# EAGLE design pcb2-1 (EAGLE 9.6.2)
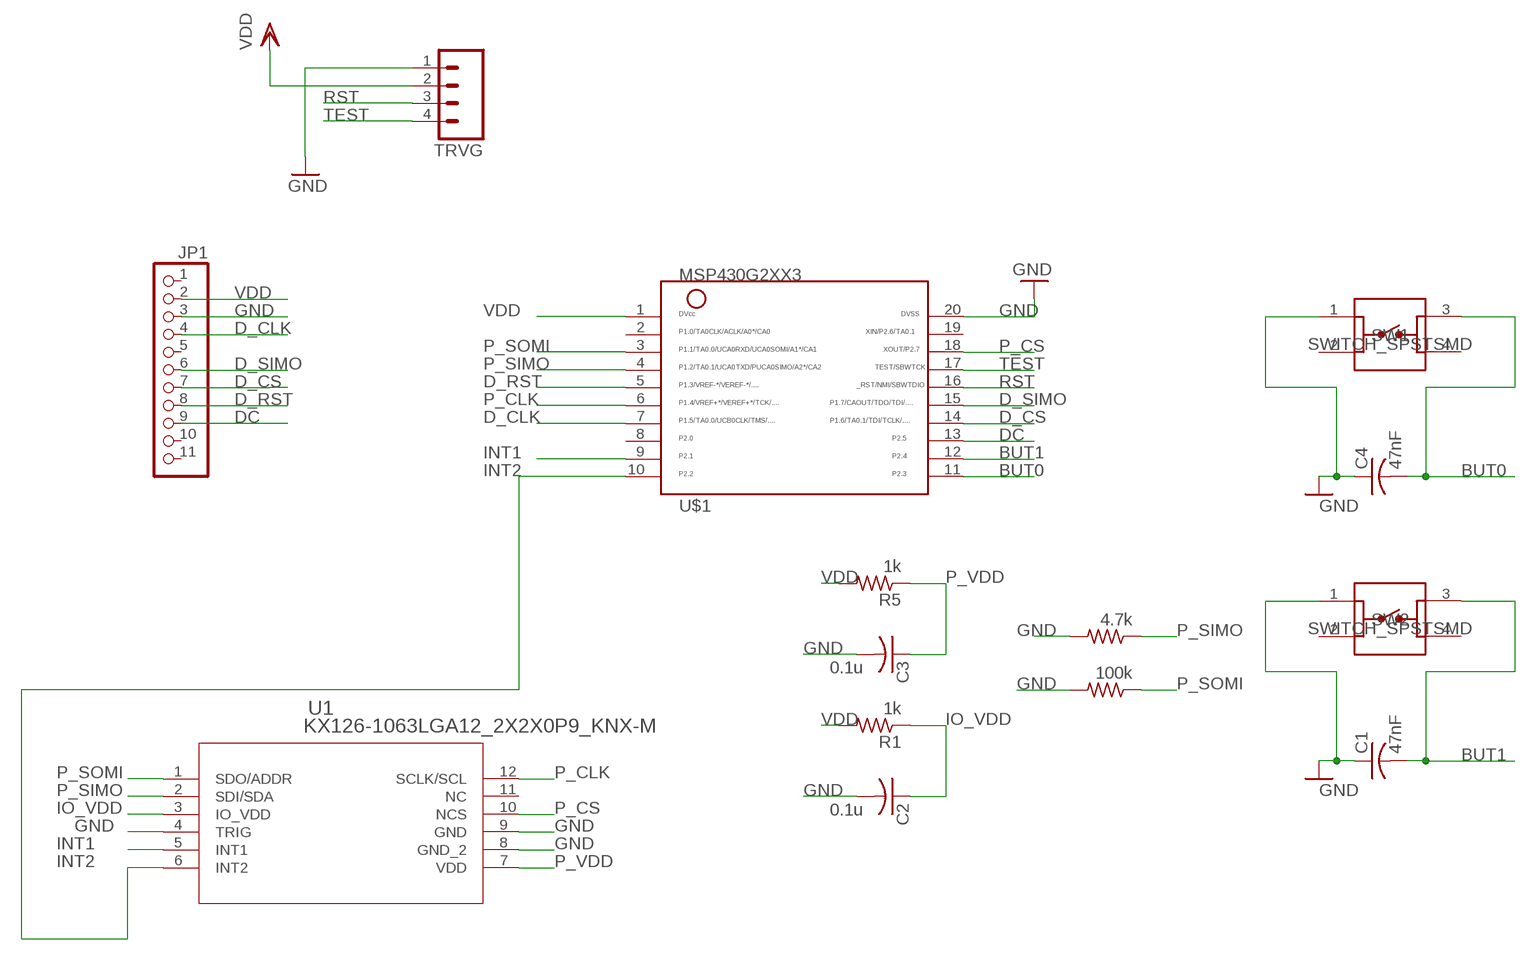
[diagram p0: schematic, sheet 1]

## Parts
C1  47nF  C-USC0603  [C0603]
C2  0.1u  C-USC0603  [C0603]
C3  0.1u  C-USC0603  [C0603]
C4  47nF  C-USC0603  [C0603]
JP1  HEADER-1X11  [1X11_ROUND]
R1  1k  R-US_R0402  [R0402]
R2  100k  R-US_R0402  [R0402]
R3  4.7k  R-US_R0402  [R0402]
R5  1k  R-US_R0402  [R0402]
SW1  SWITCH_SPSTSMD  [SW_1571563-4]
SW2  SWITCH_SPSTSMD  [SW_1571563-4]
TRVG  M04LOCK  [1X04_LOCK]
U1  KX126-1063LGA12_2X2X0P9_KNX-M  [LGA12_2X2X0P9_KNX-M]
U$1  MSP430G2XX3TSSOP  [PW20]

## Nets
BUT0: C4.2 SW1.3 U$1.11
BUT1: C1.2 SW2.3 U$1.12
D_CLK: JP1.4 U$1.7
D_CS: JP1.7 U$1.14
D_RST: JP1.8 U$1.5
D_SIMO: JP1.6 U$1.15
DC: JP1.9 U$1.13
GND: C1.1 C2.2 C3.2 C4.1 JP1.3 R2.2 R3.2 SW1.1 SW2.1 TRVG.1 U1.4(TRIG) U1.8(GND_2) U1.9(GND) U$1.20
INT1: U1.5(INT1) U$1.9
INT2: U1.6(INT2) U$1.10
IO_VDD: C2.1 R1.1 U1.3(IO_VDD)
P_CLK: U1.12(SCLK/SCL) U$1.6
P_CS: U1.10(NCS) U$1.18
P_SIMO: R3.1 U1.2(SDI/SDA) U$1.4
P_SOMI: R2.1 U1.1(SDO/ADDR) U$1.3
P_VDD: C3.1 R5.1 U1.7(VDD)
RST: TRVG.3 U$1.16
TEST: TRVG.4 U$1.17
VDD: JP1.2 R1.2 R5.2 TRVG.2 U$1.1
Unconnected: JP1.1 JP1.5 JP1.10 JP1.11 SW1.2 SW1.4 SW2.2 SW2.4 U1.11(NC) U$1.2 U$1.8 U$1.19

## Library data of the parts
C1-C4 = rcl:C-US: CAPACITOR, American symbol; SPICEPREFIX: C
JP1 = microbuilder:HEADER-1X11
R1-R3 R5 = rcl:R-US_: RESISTOR, American symbol; SPICEPREFIX: R
SW1 SW2 = ELEC327:SWITCH_SPST: TE Connectivity Alcoswitch, 6mm Switch Tactile OFF (ON) SPST Round Button PC Pins 0.05A 24VDC 100000Cycles 2.55N Thru-Hole Loose Through Hole Version 1825910-7 <https://www.digikey.com/en/products/detail/te-connectivity-alcoswitch-switches/1825910-7/1731414> Surface Mount Version 1571563-4 <https://www.digikey.com/en/products/detail/te-connectivity-alcoswitch-switches/1571563-4/2400231>
TRVG = Pendant:M04: Header 4 Standard 4-pin 0.1" header. Use with straight break away headers (SKU : PRT-00116), right angle break away headers (PRT-00553), swiss pins (PRT-00743), machine pins (PRT-00117), and female headers (PRT-00115). Molex polarized connector foot print use with SKU : PRT-08231 with associated crimp pins and housings.
U1 = Juan_pedometer:KX126-1063; COPYRIGHT: Copyright (C) 2021 Ultra Librarian. All rights reserved.; DIGI-KEY_PART_NUMBER_1: 1191-1058-2-ND; DIGI-KEY_PART_NUMBER_2: 1191-1058-1-ND; DIGI-KEY_PART_NUMBER_3: 1191-1058-6-ND; MANUFACTURER_PART_NUMBER: KX126-1063; MFR_NAME: Kionix
U$1 = ELEC327:MSP430G2XX3: MSP430G2XX3 PDIP (N) 20 Pin Package

## Board
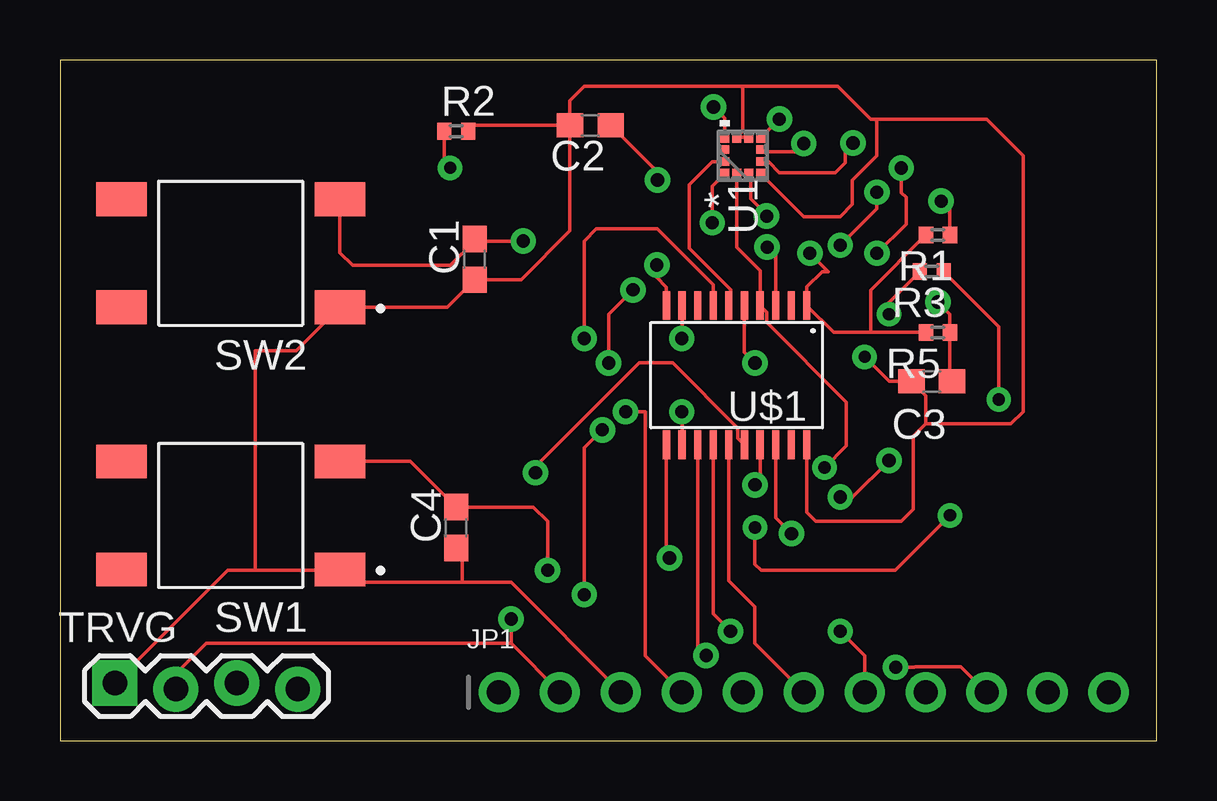
[diagram p1: board, top side]
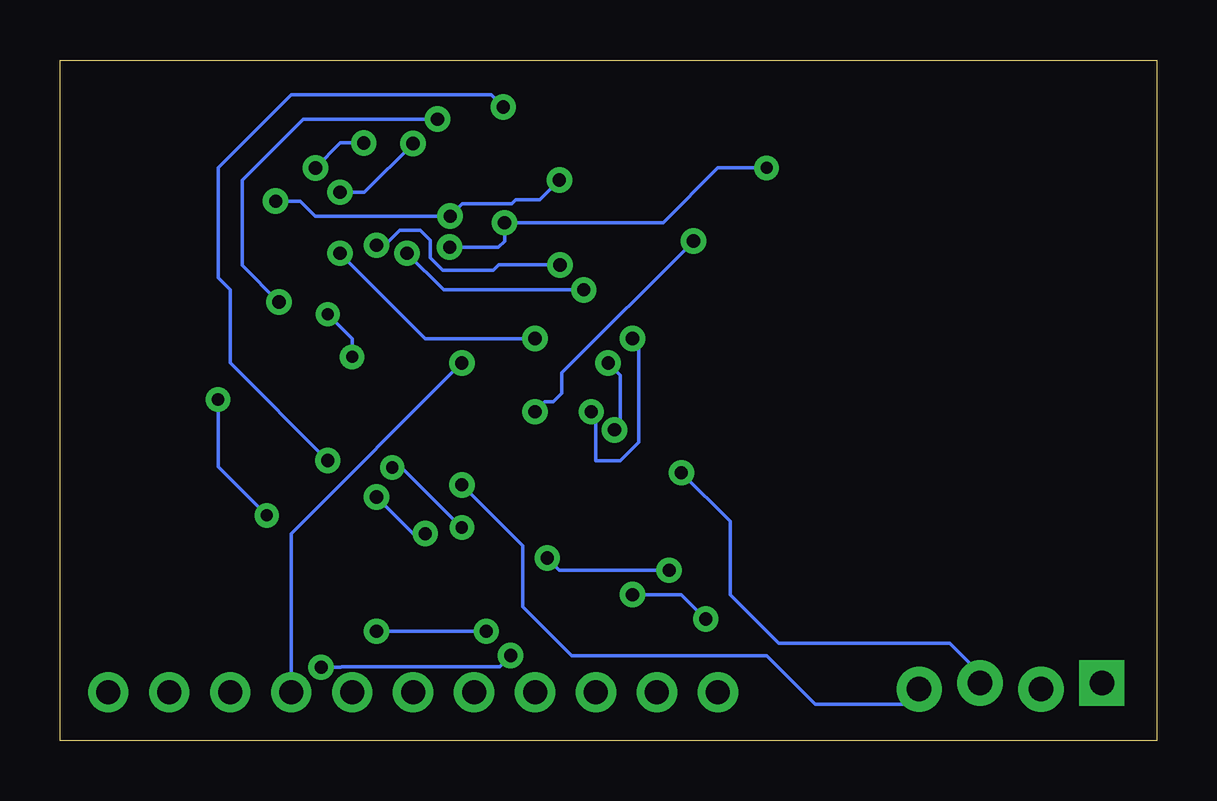
[diagram p2: board, bottom side, seen from below]

Size 45.7 x 28.37 mm. Coordinates in mm from the lower left corner, seen from the top.
Outline: 0,0 45.7,0 45.7,28.37 0,28.37 0,0
Copper layers (1*16): Top 0.035mm / dielectric 1.5mm / Bottom 0.035mm
Design rules "AdvancedCircuitsBarebones": minimum track width 6mil, minimum drill 20mil, track to track 6mil, track to pad 6mil, pad to pad 6mil, via to via 6mil, smd to smd 6mil, copper to edge 10mil, drill to drill 6mil, minimum pad ring 12mil, minimum via ring 10mil, stop-mask expansion 4mil, vias tented up to drill 25mil, thermal gap 10mil

### Footprints (pad centres in the part's own frame; a part is rotated, then mirrored left to right if it is on the bottom)
C0603 = smd 1.1 x 1: 1 -0.85,0; 2 0.85,0
1X11_ROUND = drill 1 pad 1.676: 1 -12.7,0; 2 -10.16,0; 3 -7.62,0; 4 -5.08,0; 5 -2.54,0; 6 0,0; 7 2.54,0; 8 5.08,0; 9 7.62,0; 10 10.16,0; 11 12.7,0
R0402 = smd 0.6 x 0.7: 1 -0.5,0; 2 0.5,0
SW_1571563-4 = smd 2.1 x 1.4: 1 -4.55,2.25; 2 4.55,2.25; 3 -4.55,-2.25; 4 4.55,-2.25
1X04_LOCK = drill 1.016 pad 1.88 square: 1 0,0.127 | drill 1.016 pad 1.88: 2 2.54,-0.127; 3 5.08,0.127; 4 7.62,-0.127
LGA12_2X2X0P9_KNX-M = smd 0.432 x 0.356: 1 -0.762,0.75; 2 -0.762,0.25; 3 -0.762,-0.25; 4 -0.762,-0.75; 7 0.762,-0.75; 8 0.762,-0.25; 9 0.762,0.25; 10 0.762,0.75 | smd 0.356 x 0.432: 5 -0.25,-0.787; 6 0.25,-0.787; 11 0.25,0.787; 12 -0.25,0.787
PW20 = smd 0.3 x 1.2: 1 -2.925,-2.9; 2 -2.275,-2.9; 3 -1.625,-2.9; 4 -0.975,-2.9; 5 -0.325,-2.9; 6 0.325,-2.9; 7 0.975,-2.9; 8 1.625,-2.9; 9 2.275,-2.9; 10 2.925,-2.9; 11 2.925,2.9; 12 2.275,2.9; 13 1.625,2.9; 14 0.975,2.9; 15 0.325,2.9; 16 -0.325,2.9; 17 -0.975,2.9; 18 -1.625,2.9; 19 -2.275,2.9; 20 -2.925,2.9

### Placement (x,y rotation side)
C1  17.27,20.07 90 top
C2  22.1,25.65 180 top
C3  36.32,14.99 180 top
C4  16.51,8.89 90 top
JP1  30.99,2.03 0 top
R1  36.58,21.08 180 top
R2  16.51,25.4 0 top
R3  36.32,19.56 180 top
R5  36.58,17.02 180 top
SW1  7.11,9.4 180 top
SW2  7.11,20.32 180 top
TRVG  2.29,2.29 0 top
U1  28.45,24.38 90 top
U$1  28.19,15.24 180 top

### Tracks (layer width: path | path; a pad name or v marks a point on that pad's centre or on a via)
BUT0  (via drill 0.55)
  Top 0.152: SW1.3 14.6,11.65 C4.2 19.72,9.74 20.32,9.14 v20.32,7.11 | v25.4,7.62 25.27,7.75 U$1.11
  Bottom 0.152: v20.32,7.11 24.89,7.11 v25.4,7.62
BUT1  (via drill 0.55)
  Top 0.152: SW2.3 11.66,20.34 12.19,19.81 16.26,19.81 17.27,20.83 C1.2 17.36,20.83 v19.3,20.83 | v25.91,13.72 25.92,13.71 U$1.12
  Bottom 0.152: v19.3,20.83 24.79,15.34 24.79,14.48 25.15,14.12 25.5,14.12 v25.91,13.72
D_CLK  (via drill 0.55)
  Top 0.152: JP1.4 24.38,3.56 24.38,13.72 v23.57,13.72 | v21.84,16.76 21.84,20.83 22.35,21.34 24.89,21.34 27.22,19.01 U$1.7
  Bottom 0.152: v23.57,13.72 23.37,13.52 23.37,11.68 22.35,11.68 21.59,12.45 21.59,16.51 v21.84,16.76
D_CS  (via drill 0.55)
  Top 0.152: U$1.14 27.22,5.29 v27.94,4.57 | v32.51,4.57 33.53,3.56 JP1.7
  Bottom 0.152: v27.94,4.57 v32.51,4.57
D_RST  (via drill 0.55)
  Top 0.152: U$1.5 28.52,16.18 v28.96,15.75
  Bottom 0.152: v28.96,15.75 36.07,8.64 JP1.8
D_SIMO
  Top 0.152: JP1.6 28.96,4.06 28.96,5.59 27.87,6.67 U$1.15
DC  (via drill 0.55)
  Top 0.152: U$1.13 26.57,3.91 v26.92,3.56 | v34.82,3.07 35.6,3.07 35.63,3.1 37.54,3.1 JP1.9
  Bottom 0.152: v34.82,3.07 34,3.07 33.97,3.1 27.38,3.1 v26.92,3.56
GND  (via drill 0.51)
  Top 0.152: TRVG.1 6.99,7.11 8.13,7.11 | 8.13,7.11 11.63,7.11 SW1.1 12.21,6.6 16.76,6.6 | JP1.3 18.8,6.6 16.76,6.6 | 8.13,7.11 8.13,16.26 9.85,16.26 SW2.1 16.13,18.07 C1.1 19.22,19.22 21.25,21.25 C2.2 | U$1.20 31.12,9.52 31.5,9.14 35.05,9.14 35.56,9.65 35.56,12.7 36.07,13.21 | C4.1 16.76,7.79 16.76,6.6 | 36.07,13.21 39.62,13.21 40.13,13.72 40.13,24.38 38.61,25.91 34.04,25.91 | U1.4 30.99,21.84 32.51,21.84 33.02,22.35 33.02,23.37 34.04,24.38 34.04,25.91 | U1.8 U1.9 28.45,25.4 28.45,27.28 | 28.45,27.28 32.41,27.28 33.78,25.91 34.04,25.91 | C2.2 21.25,26.68 21.84,27.28 28.45,27.28 | 36.07,13.21 36.07,14.39 C3.2 34.54,14.99 v33.53,16 | R2.2 17.26,25.65 C2.2 | R3.2 34.54,18.28 v34.54,17.78
  Bottom 0.152: v34.54,17.78 33.53,16.76 v33.53,16
INT1  (via drill 0.55)
  Top 0.152: U1.5 29.52,24.13 29.98,23.68 32.3,23.68 32.71,24.09 32.71,24.58 v33.04,24.91 | v35.05,23.88 35.05,22.84 35.25,22.64 35.25,21.54 v34.04,20.32 | v25.91,16.76 25.92,16.77 U$1.9
  Bottom 0.152: v33.04,24.91 34.01,24.91 v35.05,23.88 | v34.04,20.32 30.48,16.76 v25.91,16.76
INT2  (via drill 0.55)
  Top 0.152: v24.87,19.83 24.87,19.31 25.27,18.91 U$1.10 | v32.51,20.65 34.04,22.18 v34.04,22.86 | U1.6 29.33,24.54 30.64,24.54 v30.99,24.89
  Bottom 0.152: v24.87,19.83 27.43,19.83 27.65,19.61 29.76,19.61 30.28,20.14 30.28,20.87 30.7,21.28 31.54,21.28 32.16,20.65 v32.51,20.65 | v34.04,22.86 33.02,22.86 v30.99,24.89
IO_VDD  (via drill 0.55)
  Top 0.152: R1.1 37.08,22.13 v36.72,22.49 | v29.44,21.87 29.44,21.94 28.79,22.59 28.79,23.53 U1.3 | C2.1 24.89,23.71 v24.89,23.37
  Bottom 0.152: v36.72,22.49 35.7,22.49 35.07,21.87 v29.44,21.87 28.93,22.37 26.89,22.37 26.71,22.55 25.71,22.55 v24.89,23.37
P_CLK
  Top 0.152: U1.12 27.18,24.13 26.22,23.17 26.22,20.52 27.94,18.8 27.94,18.21 U$1.6
P_CS  (via drill 0.55)
  Top 0.152: v34.54,11.68 33.02,10.16 v32.51,10.16 | v30.48,8.64 29.82,9.3 U$1.18 | U1.10 27.7,25.95 v27.23,26.42
  Bottom 0.152: v34.54,11.68 38.61,15.75 38.61,18.8 39.12,19.3 39.12,23.88 36.07,26.92 27.74,26.92 v27.23,26.42 | v32.51,10.16 30.99,8.64 v30.48,8.64
P_SIMO  (via drill 0.51)
  Top 0.152: U1.2 28.2,20.57 29.17,19.6 U$1.4 29.44,17.87 29.44,17.45 32.77,14.12 32.77,12.3 v31.86,11.39 | R3.1 39.12,17.26 v39.12,14.22 | v37.08,9.4 34.8,7.11 29.21,7.11 28.96,7.37 v28.96,8.89
  Bottom 0.152: v39.12,14.22 39.12,11.43 v37.08,9.4 | v28.96,8.89 31.46,11.39 v31.86,11.39
P_SOMI  (via drill 0.51, 0.55)
  Top 0.152: v29.46,20.57 29.82,20.22 U$1.3 | v27.18,21.59 27.18,23.1 U1.1 | v16.26,23.88 16.01,24.12 R2.1
  Bottom 0.152: v29.46,20.57 27.43,20.57 27.18,20.83 v27.18,21.59 20.57,21.59 18.29,23.88 v16.26,23.88
P_VDD  (via drill 0.55)
  Top 0.152: C3.1 37.08,15.08 R5.1 37.08,17.79 v36.58,18.29 | v29.97,25.91 U1.7
  Bottom 0.152: v36.58,18.29 38.1,19.81 38.1,23.37 35.56,25.91 v29.97,25.91
RST  (via drill 0.55)
  Top 0.152: U$1.16 28.25,12.61 28.25,13.04 25.53,15.75 24.13,15.75 19.81,11.43 v19.81,11.18
  Bottom 0.152: v19.81,11.18 17.78,9.14 17.78,6.1 15.75,4.06 8.64,4.06 7.37,2.79 TRVG.3
TEST  (via drill 0.55)
  Top 0.152: U$1.17 29.17,10.88 v28.96,10.67
  Bottom 0.152: v28.96,10.67 26.42,8.13 26.42,5.59 25.65,4.83 | 25.65,4.83 24.38,3.56 16.26,3.56 14.22,1.52 10.54,1.52 TRVG.4 | 25.65,4.83
VDD  (via drill 0.55)
  Top 0.152: JP1.2 18.8,4.06 | 18.8,4.06 6.1,4.06 4.83,2.79 TRVG.2 | 18.8,4.06 v18.8,5.08 | v21.84,6.1 21.84,12.21 v22.6,12.96 | v22.86,15.75 22.86,17.78 v23.88,18.8 | v31.24,20.32 32,19.56 31.75,19.56 31.12,18.93 U$1.1 32.24,17.02 33.78,17.02 | R5.2 33.78,17.02 | 33.78,17.02 33.78,18.79 R1.2
  Bottom 0.152: v18.8,5.08 19.81,6.1 v21.84,6.1 | v22.86,15.75 22.35,15.24 22.35,13.21 v22.6,12.96 | v23.88,18.8 29.72,18.8 v31.24,20.32